# Altium project conn_board.PrjPcb (part 1 of 3)
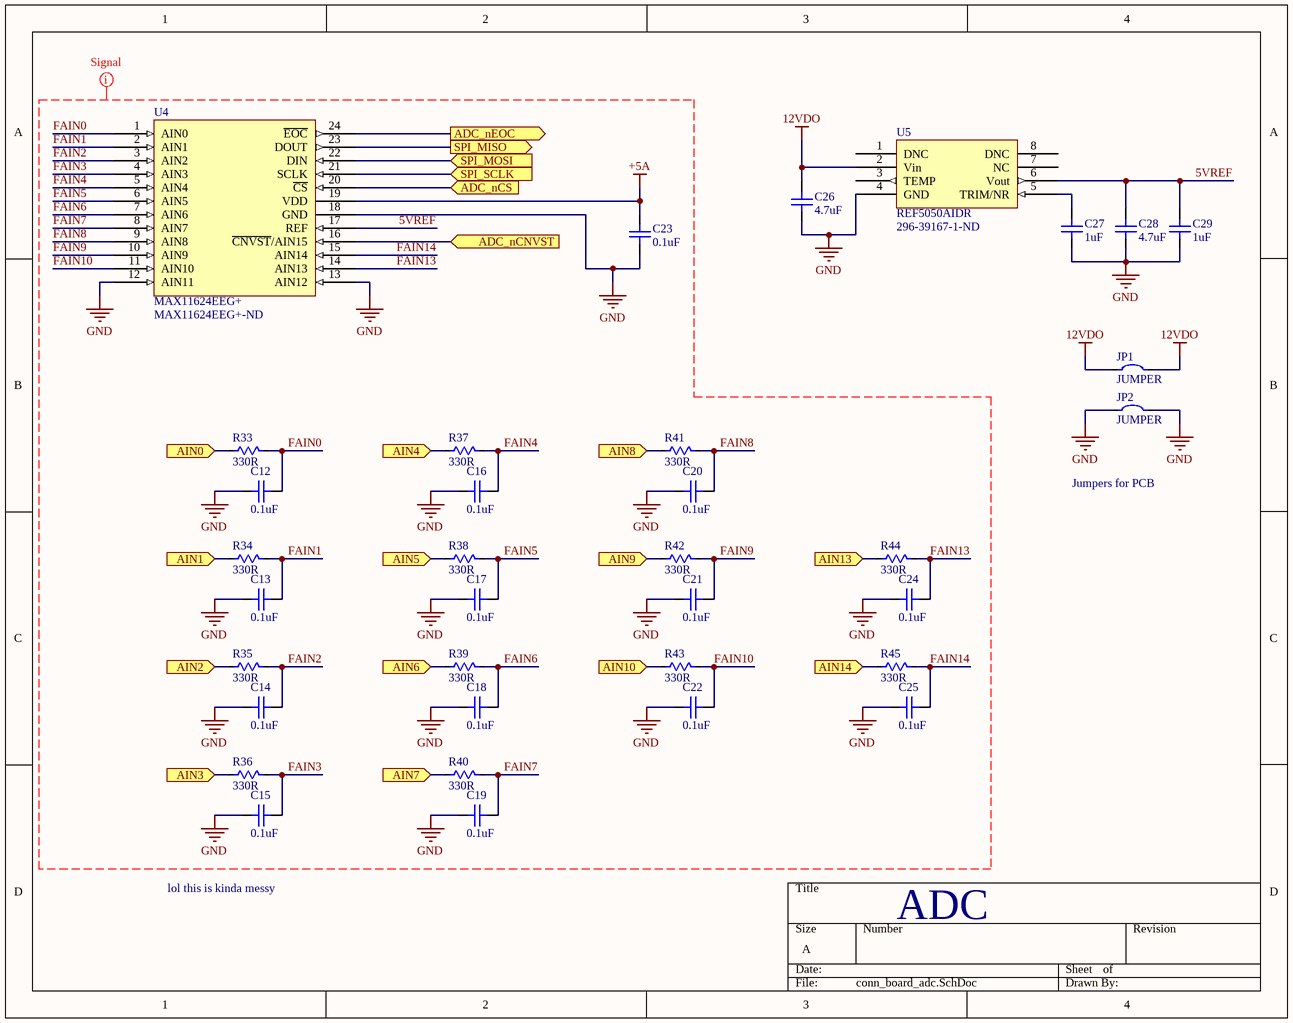
[diagram p0: conn_board_adc.SchDoc]
3 sheets, 85 parts. Net scope: flat (ports and power ports of the same name join across sheets).
Board file: conn_board.PcbDoc
Sheets:
  conn_board_adc.SchDoc
  conn_board_interfaces.SchDoc
  conn_board_power.SchDoc

## Sheet conn_board_adc.SchDoc
size A

### Parts
C12  0.1uF  [CAP_0805]
C13  0.1uF  [CAP_0805]
C14  0.1uF  [CAP_0805]
C15  0.1uF  [CAP_0805]
C16  0.1uF  [CAP_0805]
C17  0.1uF  [CAP_0805]
C18  0.1uF  [CAP_0805]
C19  0.1uF  [CAP_0805]
C20  0.1uF  [CAP_0805]
C21  0.1uF  [CAP_0805]
C22  0.1uF  [CAP_0805]
C23  0.1uF  [CAP_0805]
C24  0.1uF  [CAP_0805]
C25  0.1uF  [CAP_0805]
C26  4.7uF  [CAP_0805]
C27  1uF  [CAP_0805]
C28  4.7uF  [CAP_0805]
C29  1uF  [CAP_0805]
JP1  JUMPER  [JMP_20MM]
JP2  JUMPER  [JMP_20MM]
R33  330R  [RES_0805_PANASONIC]
R34  330R  [RES_0805_PANASONIC]
R35  330R  [RES_0805_PANASONIC]
R36  330R  [RES_0805_PANASONIC]
R37  330R  [RES_0805_PANASONIC]
R38  330R  [RES_0805_PANASONIC]
R39  330R  [RES_0805_PANASONIC]
R40  330R  [RES_0805_PANASONIC]
R41  330R  [RES_0805_PANASONIC]
R42  330R  [RES_0805_PANASONIC]
R43  330R  [RES_0805_PANASONIC]
R44  330R  [RES_0805_PANASONIC]
R45  330R  [RES_0805_PANASONIC]
U4  MAX11624EEG+  Supplier Part Number 1: MAX11624EEG+-ND  [QSOP24]
U5  REF5050AIDR  Supplier Part Number 1: 296-39167-1-ND  [SOIC_8]

### Ports
ADC_nCNVST (in), ADC_nCS (in), ADC_nEOC (out), AIN0 (in), AIN1 (in), AIN2 (in), AIN3 (in), AIN4 (in), AIN5 (in), AIN6 (in), AIN7 (in), AIN8 (in), AIN9 (in), AIN10 (in), AIN13 (in), AIN14 (in), SPI_MISO (out), SPI_MOSI (in), SPI_SCLK (in)

### Nets
12VDO: C26.2 JP1.1 JP1.2 U5.2(Vin)
+5A: C23.1 U4.19(VDD)
GND: C12.1 C13.1 C14.1 C15.1 C16.1 C17.1 C18.1 C19.1 C20.1 C21.1 C22.1 C23.2 C24.1 C25.1 C26.1 C27.1 C28.1 C29.1 JP2.1 JP2.2 U4.12(AIN11) U4.13(AIN12) U4.18(GND) U5.4(GND)
5VREF: C28.2 C29.2 U4.17(REF) U5.6(Vout)
AIN0: R33.1 ; port AIN0
AIN1: R34.1 ; port AIN1
AIN2: R35.1 ; port AIN2
AIN3: R36.1 ; port AIN3
AIN4: R37.1 ; port AIN4
AIN5: R38.1 ; port AIN5
AIN6: R39.1 ; port AIN6
AIN7: R40.1 ; port AIN7
AIN8: R41.1 ; port AIN8
AIN9: R42.1 ; port AIN9
AIN10: R43.1 ; port AIN10
FAIN0: C12.2 R33.2 U4.1(AIN0)
FAIN1: C13.2 R34.2 U4.2(AIN1)
FAIN2: C14.2 R35.2 U4.3(AIN2)
FAIN3: C15.2 R36.2 U4.4(AIN3)
FAIN4: C16.2 R37.2 U4.5(AIN4)
FAIN5: C17.2 R38.2 U4.6(AIN5)
FAIN6: C18.2 R39.2 U4.7(AIN6)
FAIN7: C19.2 R40.2 U4.8(AIN7)
FAIN8: C20.2 R41.2 U4.9(AIN8)
FAIN9: C21.2 R42.2 U4.10(AIN9)
FAIN10: C22.2 R43.2 U4.11(AIN10)
FAIN13: C24.2 R44.2 U4.14(AIN13)
FAIN14: C25.2 R45.2 U4.15(AIN14)
NetC27_2: C27.2 U5.5(TRIM/NR)
NetP3_6: U4.16(~{CNVST}/AIN15) ; port ADC_nCNVST
NetP3_7: U4.20(~{CS}) ; port ADC_nCS
NetP3_8: U4.21(SCLK) ; port SPI_SCLK
NetP3_9: U4.22(DIN) ; port SPI_MOSI
NetP3_10: U4.23(DOUT) ; port SPI_MISO
NetP3_11: U4.24(~{EOC}) ; port ADC_nEOC
NetR5_1: R45.1 ; port AIN14
NetR10_1: R44.1 ; port AIN13

Not connected (* = marked no-connect by the designer): U5 1(DNC) 3(TEMP) 7(NC) 8(DNC)

### Layout directives
net class Signal: 5VREF, +5A, FAIN0, FAIN1, FAIN2, FAIN3, FAIN4, FAIN5, FAIN6, FAIN7, FAIN8, FAIN9, FAIN10, FAIN13, FAIN14, GND

### Notes on the sheet
- Jumpers for PCB
- lol this is kinda messy
- ADC

### Library data of the parts
C12-C25 = C0805C104M3RACTU: CAP CER 0.1UF 25V X7R 0805; Manufacturer: KEMET; Dielectric Material: Ceramic; Capacitance: 100nF; Tolerance: 20%; Dissipation Factor: 5%; Supplier 1: Digi-Key; Manufacturer Part Number: C0805C104M3RACTU; RoHS: Yes; Category: Capacitor; Stock 1: 305175; Pricing 1: 1=0.10000, 10=0.06800, 50=0.03700, 100=0.03020, 500=0.02160, 1000=0.01697 (USD); Mount: Surface Mount; Case/Package: 0805; Case Code (Metric): 2012; Case Code (Imperial): 0805; Min Operating Temperature: -55°C; Max Operating Temperature: 125°C; Packaging: Tape and Reel; Package Quantity: 1; Voltage Rating (DC): 25V; Dielectric: X7R; Voltage Rating: 25V; Termination: SMD/SMT; Voltage: 25V; Length: 2mm; Height: 0.9mm; Width: 0.049inch; Thickness: 0.035inch; Depth: 1.25mm; Lead Pitch: 0.75mm; Radiation Hardening: No; REACH SVHC: No SVHC; ComponentLink1URL: http://www.mouser.com/ds/2/212/KEM_C1002_X7R_SMD-1102033.pdf?src-supplier=Mouser; ComponentLink1Description: http://www.mouser.com/ds/2/212/KEM_C1002_X7R_SMD-1102033.pdf?src-supplier=Mouser; ComponentLink2URL: http://uk.rs-online.com/webdocs/13da/0900766b813da9ff.pdf?src-supplier=RSComponents; ComponentLink2Description: http://uk.rs-online.com/webdocs/13da/0900766b813da9ff.pdf?src-supplier=RSComponents; ComponentLink3URL: http://components.arrow.com/part/dataview/0323_00178100?src-supplier=Arrow+Europe; ComponentLink3Description: http://components.arrow.com/part/dataview/0323_00178100?src-supplier=Arrow+Europe; ComponentLink4URL: https://www.alliedelec.com/m/d/6f3b5eb83d09db50ed28bdc730567b33.pdf?src-supplier=Allied+Electronics; ComponentLink4Description: https://www.alliedelec.com/m/d/6f3b5eb83d09db50ed28bdc730567b33.pdf?src-supplier=Allied+Electronics; ComponentLink5URL: http://www.farnell.com/datasheets/2746330.pdf?src-supplier=Farnell; ComponentLink5Description: http://www.farnell.com/datasheets/2746330.pdf?src-supplier=Farnell; Supplier Part Number 1: 399-8000-1-ND; ComponentLink6URL: http://www.jameco.com/Jameco/Products/ProdDS/1566487.pdf?src-supplier=Jameco; ComponentLink6Description: http://www.jameco.com/Jameco/Products/ProdDS/1566487.pdf?src-supplier=Jameco; ComponentLink7URL: http://components.arrow.com/part/dataview/2091097S3491315N7429?src-supplier=Arrow+Electronics; ComponentLink7Description: http://components.arrow.com/part/dataview/2091097S3491315N7429?src-supplier=Arrow+Electronics; ComponentLink8URL: https://www.alliedelec.com/m/d/e7aa2b5497e2375e4ffc0e8be19e16e2.pdf?src-supplier=Allied+Electronics; ComponentLink8Description: https://www.alliedelec.com/m/d/e7aa2b5497e2375e4ffc0e8be19e16e2.pdf?src-supplier=Allied+Electronics; ComponentLink9URL: http://uk.rs-online.com/webdocs/13da/0900766b813daa05.pdf?src-supplier=RSComponents; ComponentLink9Description: http://uk.rs-online.com/webdocs/13da/0900766b813daa05.pdf?src-supplier=RSComponents; ComponentLink10URL: http://www.farnell.com/datasheets/2746330.pdf?src-supplier=Element14; ComponentLink10Description: http://www.farnell.com/datasheets/2746330.pdf?src-supplier=Element14; ComponentLink11URL: https://api.kemet.com/component-edge/download/datasheet/C0805C104M3RACTU.pdf?src-supplier=Digi-Key; ComponentLink11Description: https://api.kemet.com/component-edge/download/datasheet/C0805C104M3RACTU.pdf?src-supplier=Digi-Key; ComponentLink12URL: http://www.farnell.com/datasheets/1828800.pdf?src-supplier=Newark; ComponentLink12Description: http://www.farnell.com/datasheets/1828800.pdf?src-supplier=Newark; ComponentLink13URL: http://www.farnell.com/datasheets/2746330.pdf?src-supplier=Newark; ComponentLink13Description: http://www.farnell.com/datasheets/2746330.pdf?src-supplier=Newark; ComponentLink14URL: http://capacitoredge.kemet.com/capedge2/DataSheet?pn=C0805C104M3RACTU&src-supplier=Avnet; ComponentLink14Description: http://capacitoredge.kemet.com/capedge2/DataSheet?pn=C0805C104M3RACTU&src-supplier=Avnet
C26 C28 = CL21A475KAQNNNE: SAMSUNG ELECTRO-MECHANICS - CL21A475KAQNNNE - SMD Multilayer Ceramic Capacitor, 4.7 µF, 25 V, 0805 [2012 Metric], ± 10%, X5R, CL Series; Voltage Rating (DC): 25V; Supplier 1: Digi-Key; Manufacturer: Samsung; Manufacturer Part Number: CL21A475KAQNNNE; RoHS: Yes; Category: Ceramic Capacitors; Stock 1: 671990; Pricing 1: 1=0.11000, 10=0.08100, 50=0.04600, 100=0.03820, 500=0.02678, 1000=0.02216 (USD); Mount: Surface Mount; Case/Package: 0805; Case Code (Metric): 2012; Case Code (Imperial): 0805; Min Operating Temperature: -55°C; Max Operating Temperature: 85°C; Dielectric: X5R; Package Quantity: 1; Packaging: Tape and Reel; Capacitance: 4.7uF; Tolerance: 10%; Voltage Rating: 25V; Length: 2mm; Width: 0.049inch; Height: 1.25mm; Thickness: 0.055inch; Depth: 1.25mm; Radiation Hardening: No; Lead Free: Lead Free; ComponentLink1URL: https://datasheet.ciiva.com/25798/cl21a475kaqnnne-25798882.pdf?src-supplier=Digi-Key; ComponentLink1Description: https://datasheet.ciiva.com/25798/cl21a475kaqnnne-25798882.pdf?src-supplier=Digi-Key; Supplier Part Number 1: 1276-1244-1-ND
C27 C29 = C0805C105Z4VACTU: Cap Ceramic 1uF 16V Y5V -20% to 80% Pad SMD 0805 85C T/R; Manufacturer: KEMET; Dissipation Factor: 7%; Supplier 1: Digi-Key; Manufacturer Part Number: C0805C105Z4VACTU; Category: Capacitor; Stock 1: 83211; Pricing 1: 1=0.11000, 10=0.08100, 50=0.04420, 100=0.03620, 500=0.02584, 1000=0.02030 (USD); Mount: Surface Mount; Case/Package: 0805; Number of Pins: 2; Case Code (Metric): 2012; Case Code (Imperial): 0805; Contact Material: Tin; Dielectric Material: Ceramic; Min Operating Temperature: -30°C; Max Operating Temperature: 85°C; Package Quantity: 1; Capacitance: 1uF; Voltage Rating: 16V; Tolerance: 80%; Packaging: Tape and Reel; Voltage Rating (DC): 16V; Dielectric: Y5V; Termination: SMD/SMT; Voltage: 16V; Length: 2mm; Height: 1.25mm; Width: 0.049inch; Thickness: 0.055inch; Lead Pitch: 0.75mm; Depth: 1.25mm; Radiation Hardening: No; REACH SVHC: No SVHC; Lead Free: Lead Free; ComponentLink1URL: https://datasheet.ciiva.com/6074/1698780-6074369.pdf?src-supplier=Farnell; ComponentLink1Description: https://datasheet.ciiva.com/6074/1698780-6074369.pdf?src-supplier=Farnell; ComponentLink2URL: https://datasheet.ciiva.com/16623/datasheetpn-c0805c105z4vac7800-16623623.pdf?src-supplier=Avnet+Europe; ComponentLink2Description: https://datasheet.ciiva.com/16623/datasheetpn-c0805c105z4vac7800-16623623.pdf?src-supplier=Avnet+Europe; ComponentLink3URL: https://datasheet.ciiva.com/14604/70095383-14604106.pdf?src-supplier=Allied+Electronics; ComponentLink3Description: https://datasheet.ciiva.com/14604/70095383-14604106.pdf?src-supplier=Allied+Electronics; ComponentLink4URL: https://datasheet.ciiva.com/7600/1698780-7600029.pdf?src-supplier=Newark; ComponentLink4Description: https://datasheet.ciiva.com/7600/1698780-7600029.pdf?src-supplier=Newark; ComponentLink5URL: https://datasheet.ciiva.com/14589/70095383-14589407.pdf?src-supplier=Allied+Electronics; ComponentLink5Description: https://datasheet.ciiva.com/14589/70095383-14589407.pdf?src-supplier=Allied+Electronics; ComponentLink6URL: http://datasheet.octopart.com/C0805C105Z4VACTU-Kemet-datasheet-13692877.pdf?src-supplier=Element14; ComponentLink6Description: http://datasheet.octopart.com/C0805C105Z4VACTU-Kemet-datasheet-13692877.pdf?src-supplier=Element14; ComponentLink7URL: http://datasheet.octopart.com/C0805C105Z4VACTU-Kemet-datasheet-503297.pdf?src-supplier=Newark; ComponentLink7Description: http://datasheet.octopart.com/C0805C105Z4VACTU-Kemet-datasheet-503297.pdf?src-supplier=Newark; ComponentLink8URL: http://datasheet.octopart.com/C0805C105Z4VACTU-KEMET-datasheet-101576167.pdf?src-supplier=Farnell; ComponentLink8Description: http://datasheet.octopart.com/C0805C105Z4VACTU-KEMET-datasheet-101576167.pdf?src-supplier=Farnell; ComponentLink9URL: http://datasheet.octopart.com/C0805C105Z4VACTU-KEMET-datasheet-83957834.pdf?src-supplier=TME; ComponentLink9Description: http://datasheet.octopart.com/C0805C105Z4VACTU-KEMET-datasheet-83957834.pdf?src-supplier=TME; ComponentLink10URL: http://datasheet.octopart.com/C0805C105Z4VACTU-Kemet-datasheet-5313890.pdf?src-supplier=Verical; ComponentLink10Description: http://datasheet.octopart.com/C0805C105Z4VACTU-Kemet-datasheet-5313890.pdf?src-supplier=Verical; ComponentLink11URL: http://datasheet.octopart.com/C0805C105Z4VAC-TU-Kemet-datasheet-8204015.pdf?src-supplier=Jameco; ComponentLink11Description: http://datasheet.octopart.com/C0805C105Z4VAC-TU-Kemet-datasheet-8204015.pdf?src-supplier=Jameco; ComponentLink12URL: http://datasheet.octopart.com/C0805C105Z4VACTU-Kemet-datasheet-464.pdf?src-supplier=Allied+Electronics; ComponentLink12Description: http://datasheet.octopart.com/C0805C105Z4VACTU-Kemet-datasheet-464.pdf?src-supplier=Allied+Electronics; ComponentLink13URL: http://datasheet.octopart.com/C0805C105Z4VACTU-Kemet-datasheet-11554470.pdf?src-supplier=Arrow; ComponentLink13Description: http://datasheet.octopart.com/C0805C105Z4VACTU-Kemet-datasheet-11554470.pdf?src-supplier=Arrow; ComponentLink14URL: http://datasheet.octopart.com/C0805C105Z4VACTU-Kemet-datasheet-66128697.pdf?src-supplier=Element14; ComponentLink14Description: http://datasheet.octopart.com/C0805C105Z4VACTU-Kemet-datasheet-66128697.pdf?src-supplier=Element14; ComponentLink15URL: http://datasheet.octopart.com/C0805C105Z4VACTU-Kemet-datasheet-66325528.pdf?src-supplier=Newark; ComponentLink15Description: http://datasheet.octopart.com/C0805C105Z4VACTU-Kemet-datasheet-66325528.pdf?src-supplier=Newark; ComponentLink16URL: http://datasheet.octopart.com/C0805C105Z4VACTU-Kemet-datasheet-67847115.pdf?src-supplier=TME; ComponentLink16Description: http://datasheet.octopart.com/C0805C105Z4VACTU-Kemet-datasheet-67847115.pdf?src-supplier=TME; ComponentLink17URL: http://datasheet.octopart.com/C0805C105Z4VACTU-KEMET-datasheet-84169754.pdf; ComponentLink17Description: http://datasheet.octopart.com/C0805C105Z4VACTU-KEMET-datasheet-84169754.pdf; ComponentLink18URL: http://datasheet.octopart.com/C0805C105Z4VACTU-KEMET-datasheet-41193421.pdf?src-supplier=Master+Electronics; ComponentLink18Description: http://datasheet.octopart.com/C0805C105Z4VACTU-KEMET-datasheet-41193421.pdf?src-supplier=Master+Electronics; Supplier Part Number 1: 399-8011-1-ND
R33-R45 = ERA-6AED331V: Res Thin Film 0805 330 Ohm 0.5% 0.125W(1/8W) ±25ppm/C Molded SMD Automotive Punched T/R; Manufacturer: Panasonic; Temperature Coefficient: 25ppm/°C; Power Rating: 125mW; Voltage Rating: 200V; Supplier 1: Digi-Key; Manufacturer Part Number: ERA-6AED331V; RoHS: Yes; Category: Resistor; Stock 1: 11862; Pricing 1: 1=0.10000, 10=0.09400, 25=0.06480, 50=0.05040, 100=0.03600, 250=0.02808, 500=0.02232, 1000=0.01584 (USD); Case/Package: 0805; Case Code (Metric): 2012; Case Code (Imperial): 0805; Min Operating Temperature: -55°C; Max Operating Temperature: 155°C; Package Quantity: 5000; Packaging: Tape and Reel; Resistance: 330R; Tolerance: 0.5%; Length: 2mm; Height: 0.5mm; Width: 1.25mm; Lead Free: Lead Free; ComponentLink1URL: https://datasheet.ciiva.com/24071/aoa0000ce26-197354-24071480.pdf?src-supplier=Mouser; ComponentLink1Description: https://datasheet.ciiva.com/24071/aoa0000ce26-197354-24071480.pdf?src-supplier=Mouser; Supplier Part Number 1: P123837CT-ND; Mount: Surface Mount; Contact Plating: Tin; Termination: SMD/SMT; Resistor Type: Thin Film; Depth: 1.25mm; Military Standard: Not; ComponentLink2URL: https://datasheet.ciiva.com/9182/aoa0000ce26-9182970.pdf?src-supplier=Avnet; ComponentLink2Description: https://datasheet.ciiva.com/9182/aoa0000ce26-9182970.pdf?src-supplier=Avnet
U4 = MAX11624EEG+: GLOVE, POLYAMIDE, L/FREE, PU, SIZE 6 - More Details; Manufacturer: Maxim; Resolution: 10b; Sampling Rate: 300000S/s; Number of A/D Converters: 1; Number of Analog Inputs: 16; Polarity: Unipolar; Signal to Noise Ratio (SNR): 49dB; Number of Bits: 10; Supply Type: Single; Conversion Rate: 300KS/s; Interface: SPI,Serial; Max Power Dissipation: 762mW; Operating Supply Voltage: 5.25V; Supplier 1: Digi-Key; Manufacturer Part Number: MAX11624EEG+; RoHS: Yes; Category: IC; Stock 1: 35; Pricing 1: 1=6.76000, 10=6.11000, 25=5.82520, 100=4.83080, 250=4.82100 (USD); Mount: Surface Mount; Case/Package: QSOP; Number of Pins: 24; Min Operating Temperature: -40°C; Max Operating Temperature: 85°C; Number of Converters: 1; Packaging: Rail/Tube; Number of Channels: 16; Package Quantity: 50; Radiation Hardening: No; ComponentLink1URL: https://datasheet.ciiva.com/16611/max11618-max11625-16611389.pdf?src-supplier=Avnet+Europe; ComponentLink1Description: https://datasheet.ciiva.com/16611/max11618-max11625-16611389.pdf?src-supplier=Avnet+Europe; ComponentLink2URL: https://datasheet.ciiva.com/3039/max11618-max11625-3039027.pdf?src-supplier=Avnet; ComponentLink2Description: https://datasheet.ciiva.com/3039/max11618-max11625-3039027.pdf?src-supplier=Avnet
U5 = REF5050AIDR: TEXAS INSTRUMENTS - REF5050AIDR - VOLTAGE REF, SERIES, 5V, SOIC-8; Max Input Voltage: 18V; Max Output Current: 10mA; Min Input Voltage: 5.2V; Temperature Coefficient: 3ppm/°C; Quiescent Current: 1mA; Tolerance: 0.1%; Nominal Supply Current: 800uA; Number of Channels: 1; Operating Supply Current: 1.2mA; Output Type: Fixed; Supplier 1: Digi-Key; Manufacturer: Texas Instruments; Manufacturer Part Number: REF5050AIDR; RoHS: Yes; Category: Voltage References; Stock 1: 3640; Pricing 1: 1=2.92000, 10=2.61800, 25=2.47520, 100=2.03500, 250=1.82600, 500=1.76000, 1000=1.46300 (USD); Case/Package: D; Number of Pins: 8; Weight: 0.002677oz; Min Operating Temperature: -40°C; Max Operating Temperature: 125°C; Output Voltage: 5V; Packaging: Tape and Reel; Package Quantity: 2500; Output Current: 10mA; Reference Type: Series; Reference Voltage: 5V; Min Output Voltage: 5V; Radiation Hardening: No; Lead Free: Lead Free; REACH SVHC: No SVHC; ComponentLink1URL: https://datasheet.ciiva.com/4065/43001021s8324725n7713-4065643.pdf?src-supplier=Arrow+Electronics; ComponentLink1Description: https://datasheet.ciiva.com/4065/43001021s8324725n7713-4065643.pdf?src-supplier=Arrow+Electronics; ComponentLink2URL: https://datasheet.ciiva.com/3236/ref5050-3236312.pdf?src-supplier=Avnet; ComponentLink2Description: https://datasheet.ciiva.com/3236/ref5050-3236312.pdf?src-supplier=Avnet; ComponentLink3URL: https://datasheet.ciiva.com/2012/ref5020-2012761.pdf?src-supplier=Digi-Key; ComponentLink3Description: https://datasheet.ciiva.com/2012/ref5020-2012761.pdf?src-supplier=Digi-Key

## Sheet conn_board_interfaces.SchDoc
size A
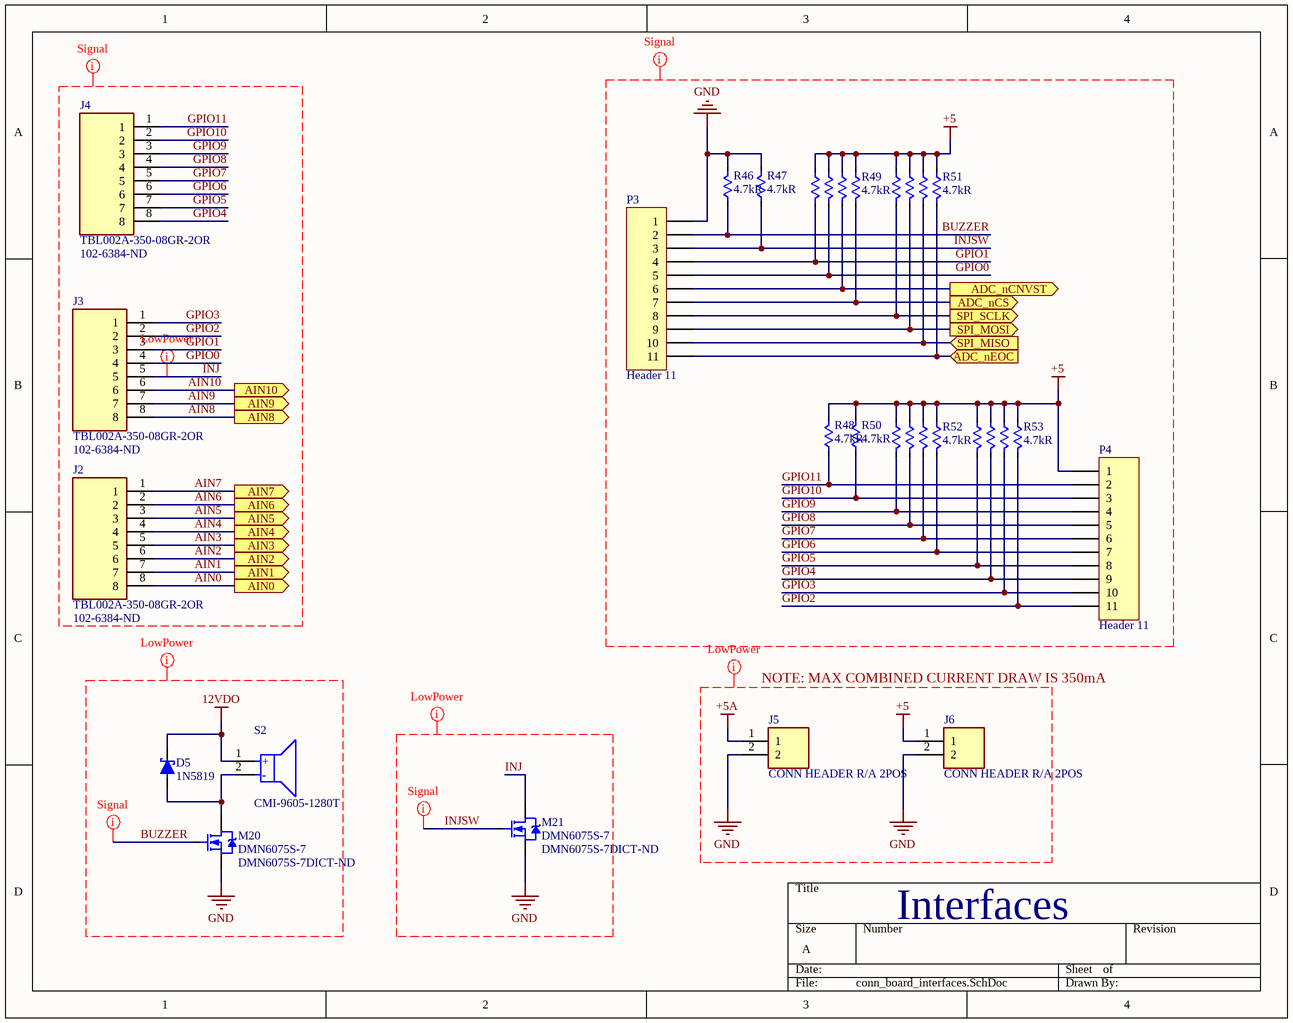
[diagram p1: conn_board_interfaces.SchDoc]

### Parts
D5  1N5819  [SOD123]
J2  TBL002A-350-08GR-2OR  Supplier Part Number 1: 102-6384-ND  [CUI_TBL002A-350-08GR-2OR]
J3  TBL002A-350-08GR-2OR  Supplier Part Number 1: 102-6384-ND  [CUI_TBL002A-350-08GR-2OR]
J4  TBL002A-350-08GR-2OR  Supplier Part Number 1: 102-6384-ND  [CUI_TBL002A-350-08GR-2OR]
J5  CONN HEADER R/A 2POS  [2 POS MOLEX]
J6  CONN HEADER R/A 2POS  [2 POS MOLEX]
M20  DMN6075S-7  Supplier Part Number 1: DMN6075S-7DICT-ND  [FP-SOT23-MFG]
M21  DMN6075S-7  Supplier Part Number 1: DMN6075S-7DICT-ND  [FP-SOT23-MFG]
P3  Header 11  [HDR1X11]
P4  Header 11  [HDR1X11]
R46  4.7kR  [RES_0805_PANASONIC]
R47  4.7kR  [RES_0805_PANASONIC]
R48  4.7kR  [RES_0805_PANASONIC]
R49  4.7kR  [CAY16-472J4LF]
R50  4.7kR  [RES_0805_PANASONIC]
R51  4.7kR  [CAY16-472J4LF]
R52  4.7kR  [CAY16-472J4LF]
R53  4.7kR  [CAY16-472J4LF]
S2  CMI-9605-1280T  [CMI-9605-1280T]

### Ports
ADC_nCNVST (out), ADC_nCS (out), ADC_nEOC (in), AIN0 (out), AIN1 (out), AIN2 (out), AIN3 (out), AIN4 (out), AIN5 (out), AIN6 (out), AIN7 (out), AIN8 (out), AIN9 (out), AIN10 (out), SPI_MISO (in), SPI_MOSI (out), SPI_SCLK (out)

### Nets
12VDO: D5.1 S2.1(+)
+5: J6.1 P4.1 R48.2 R49.2 R49.4 R49.6 R49.8 R50.2 R51.2 R51.4 R51.6 R51.8 R52.2 R52.4 R52.6 R52.8 R53.2 R53.4 R53.6 R53.8
+5A: J5.1
GND: J5.2 J6.2 M20.S M21.S P3.1 R46.2 R47.2
AIN0: J2.8 ; port AIN0
AIN1: J2.7 ; port AIN1
AIN2: J2.6 ; port AIN2
AIN3: J2.5 ; port AIN3
AIN4: J2.4 ; port AIN4
AIN5: J2.3 ; port AIN5
AIN6: J2.2 ; port AIN6
AIN7: J2.1 ; port AIN7
AIN8: J3.8 ; port AIN8
AIN9: J3.7 ; port AIN9
AIN10: J3.6 ; port AIN10
BUZZER: M20.G P3.2 R46.1
GPIO0: J3.4 P3.5 R49.3
GPIO1: J3.3 P3.4 R49.1
GPIO2: J3.2 P4.11 R53.7
GPIO3: J3.1 P4.10 R53.5
GPIO4: J4.8 P4.9 R53.3
GPIO5: J4.7 P4.8 R53.1
GPIO6: J4.6 P4.7 R52.7
GPIO7: J4.5 P4.6 R52.5
GPIO8: J4.4 P4.5 R52.3
GPIO9: J4.3 P4.4 R52.1
GPIO10: J4.2 P4.3 R50.1
GPIO11: J4.1 P4.2 R48.1
INJ: J3.5 M21.D
INJSW: M21.G P3.3 R47.1
NetD5_2: D5.2 M20.D S2.2(-)
NetP3_6: P3.6 R49.5 ; port ADC_nCNVST
NetP3_7: P3.7 R49.7 ; port ADC_nCS
NetP3_8: P3.8 R51.1 ; port SPI_SCLK
NetP3_9: P3.9 R51.3 ; port SPI_MOSI
NetP3_10: P3.10 R51.5 ; port SPI_MISO
NetP3_11: P3.11 R51.7 ; port ADC_nEOC

### Layout directives
net class Signal: +5, AIN0, AIN1, AIN2, AIN3, AIN4, AIN5, AIN6, AIN7, AIN8, AIN9, AIN10, BUZZER, GND, GPIO0, GPIO1, GPIO2, GPIO3, GPIO4, GPIO5, GPIO6, GPIO7, GPIO8, GPIO9, GPIO10, GPIO11, INJ, INJSW
net class LowPower: 12VDO, +5, +5A, BUZZER, GND, INJ, INJSW
mark named Signal: BUZZER, INJSW

### Notes on the sheet
- NOTE: MAX COMBINED CURRENT DRAW IS 350mA
- Interfaces

### Library data of the parts
D5 = 1N5819HW-7-F: DIODES INC. - 1N5819HW-7-F - DIODE, SCKY RECTI, 1A, 40V, SOD123; Element Configuration: Single; Peak Non-Repetitive Surge Current: 25A; Forward Voltage: 450mV; Peak Reverse Current: 50uA; Polarity: Standard; Capacitance: 110pF; Max Power Dissipation: 450mW; Supplier 1: Digi-Key; Manufacturer: Diodes; Manufacturer Part Number: 1N5819HW-7-F; RoHS: Yes; Category: Diode; Stock 1: 502732; Pricing 1: 1=0.40000, 10=0.30100, 25=0.26360, 100=0.14310, 500=0.11678, 1000=0.08664 (USD); Case/Package: SOD-123-2; Number of Pins: 2; Weight: 0.000353oz; Contact Plating: Tin,Matte; Min Operating Temperature: -65°C; Max Operating Temperature: 125°C; Packaging: Tape and Reel; Package Quantity: 3000; Forward Current: 1A; Max Repetitive Reverse Voltage (Vrrm): 40V; Average Rectified Current: 1A; Max Reverse Voltage (DC): 40V; Max Forward Surge Current (Ifsm): 25A; Current Rating: 1A; Voltage Rating (DC): 40V; Output Current: 1A; Termination: SMD/SMT; Length: 2.85mm; Height: 1.25mm; Width: 1.7mm; Radiation Hardening: No; Lead Free: Lead Free; REACH SVHC: No SVHC; ComponentLink1URL: https://datasheet.ciiva.com/16303/ds30217-16303296.pdf?src-supplier=Future+Electronics; ComponentLink1Description: https://datasheet.ciiva.com/16303/ds30217-16303296.pdf?src-supplier=Future+Electronics; ComponentLink2URL: https://datasheet.ciiva.com/27092/1538419-27092484.pdf?src-supplier=Jameco; ComponentLink2Description: https://datasheet.ciiva.com/27092/1538419-27092484.pdf?src-supplier=Jameco; ComponentLink3URL: https://datasheet.ciiva.com/912/ds30217-912801.pdf?src-supplier=Digi-Key; ComponentLink3Description: https://datasheet.ciiva.com/912/ds30217-912801.pdf?src-supplier=Digi-Key; ComponentLink4URL: https://datasheet.ciiva.com/1177/ds30217-1177089.pdf?src-supplier=Element14; ComponentLink4Description: https://datasheet.ciiva.com/1177/ds30217-1177089.pdf?src-supplier=Element14; ComponentLink5URL: https://datasheet.ciiva.com/912/ds30217-912802.pdf?src-supplier=Digi-Key; ComponentLink5Description: https://datasheet.ciiva.com/912/ds30217-912802.pdf?src-supplier=Digi-Key; ComponentLink6URL: https://datasheet.ciiva.com/912/ds30217-912803.pdf?src-supplier=Digi-Key; ComponentLink6Description: https://datasheet.ciiva.com/912/ds30217-912803.pdf?src-supplier=Digi-Key; ComponentLink7URL: https://datasheet.ciiva.com/8303/ds30217-8303132.pdf?src-supplier=Avnet; ComponentLink7Description: https://datasheet.ciiva.com/8303/ds30217-8303132.pdf?src-supplier=Avnet; ComponentLink8URL: https://datasheet.ciiva.com/25919/ds30217-25919644.pdf?src-supplier=Avnet+Europe; ComponentLink8Description: https://datasheet.ciiva.com/25919/ds30217-25919644.pdf?src-supplier=Avnet+Europe; Supplier Part Number 1: 1N5819HW-FDICT-ND
J2-J4 = TBL002A-350-08GR-2OR: 1~24 Poles, Screwless, 45Â°, 3.50 Pitch, 24~20 (AWG), Terminal Block Connector; MF: CUI Devices; SnapEDA_Link: https://www.snapeda.com/parts/TBL002A-350-08GR-2OR/CUI%20Devices/view-part/3233590/?ref=snap; Availability: Unavailable; Price: None; MP: TBL002A-350-08GR-2OR; Package: None; Value: *; Category: Connector; Supplier 1: Digi-Key
J5 J6 = 1724480002: Manufacturer: Molex; Connector Type: Male Pin; Number of Circuits: 2; Row Spacing: 0.165inch; Glow Wire Compliant: Compliant; Supplier 1: Digi-Key; Manufacturer Part Number: 1724480002; RoHS: No; Category: Headers and Wire Housings; Stock 1: 6210; Pricing 1: 1=0.55000, 10=0.46000, 100=0.35780, 1000=0.28116, 5000=0.24708, 10000=0.23004 (USD); Mount: Through Hole; Number of Pins: 2; Contact Plating: Tin; Color: Black; Orientation: Right Angle; Packaging: Tray; Number of Positions: 2; Number of Rows: 2; Termination: Solder; Fastening Type: Ramp; ComponentLink1URL: https://www.molex.com/pdm_docs/sd/1724480002_sd.pdf?src-supplier=Digi-Key; ComponentLink1Description: https://www.molex.com/pdm_docs/sd/1724480002_sd.pdf?src-supplier=Digi-Key; Supplier Part Number 1: WM16206-ND
M20 M21 = CMP-12801-000014-1: MOSFET 60V N-Ch Enh FET 20Vgss 0.8W 600pF; Manufacturer: Diodes Inc.; Max Junction Temp: +150°C; Continuous Drain Current: 2A; Rthja Max: 157°C/W; Turn On Delay Time: 3.5ns; Gate To Source Voltage: 20V; Input Capacitace At Vds: 606pF @ 20V; Depletion Mode: False; Number Of Channels: 1; Pulse Drain Current: 12A; Standoff Height: 0.013mm; Turn Off Delay Time: 35ns; Threshold Vgs Max: 3V; Automotive Grade: Grade 0; Max Forward Diode Voltage: 1.2V; Gate Charge At Vgs: 12.3nC @ 10V; Threshold Vgs Min: 1V; Drain To Source Resistance: 69mΩ; Rds On Max: 85mR; Input Capacitance: 606pF; Max Power Dissipation: 800mW; Device Class L2: Transistors; Height: 1.1mm; ComponentLink2Description: Datasheet; Footprint Url: https://www.diodes.com/assets/Package-Files/SOT23.pdf; Device Class L1: Discrete Semiconductors; Digikey Description: MOSFET N-CH 60V 2A SOT23-3; Device Class L3: MOSFETs; Mouser Description: MOSFET 60V N-Ch Enh FET 20Vgss 0.8W 600pF; Manufacturer Part Number: DMN6075S-7; Package: SOT23; Power Dissipation: 0.8W; Temperature Range High: +150°C; Drain To Source Breakdown Voltage: 60V; Automotive: Yes; Lead Free: Yes; ComponentLink2URL: https://www.diodes.com/assets/Datasheets/DMN6075S.pdf; Category: Trans; Temperature Range Low: -55°C; Number Of N Channels: 1; Octopart: https://octopart.com/dmn6075s-7-diodes+inc.-55697882; RoHS: TRUE; Temperature: -55°C to +150°C; Drain To Source Voltage: 60V; Supplier 1: Digi-Key; Stock 1: 363651; Pricing 1: 1=0.33000, 10=0.23000, 25=0.21440, 100=0.11630, 500=0.09486, 1000=0.07038 (USD); Mount: Surface Mount; Case/Package: TO-236-3; Min Operating Temperature: -55°C; Max Operating Temperature: 150°C; Packaging: Tape and Reel; Drain to Source Voltage (Vdss): 60V; Continuous Drain Current (ID): 2A; ComponentLink1URL: http://www.mouser.com/ds/2/115/DMN6075S-532804.pdf?src-supplier=Mouser; ComponentLink1Description: http://www.mouser.com/ds/2/115/DMN6075S-532804.pdf?src-supplier=Mouser; ComponentLink3URL: https://www.diodes.com/assets/Datasheets/DMN6075S.pdf?src-supplier=Digi-Key; ComponentLink3Description: https://www.diodes.com/assets/Datasheets/DMN6075S.pdf?src-supplier=Digi-Key
P3 P4 = Header 11: Header, 11-Pin; LatestRevisionDate: 17-Jul-2002; LatestRevisionNote: Re-released for DXP Platform.; Publisher: Altium Limited
R46-R48 R50 = ERA-6AED472V: Res Thin Film 0805 4.7K Ohm 0.5% 0.125W(1/8W) ±25ppm/C Molded SMD Automotive Punched T/R; Manufacturer: Panasonic; Temperature Coefficient: 25ppm/°C; Power Rating: 125mW; Voltage Rating: 100V; Supplier 1: Digi-Key; Manufacturer Part Number: ERA-6AED472V; RoHS: Yes; Category: Chip SMD Resistors; Stock 1: 25343; Pricing 1: 1=0.10000, 10=0.09400, 100=0.03600, 1000=0.01584, 2500=0.01368 (USD); Case/Package: 0805; Case Code (Metric): 2012; Case Code (Imperial): 0805; Min Operating Temperature: -55°C; Max Operating Temperature: 155°C; Package Quantity: 5000; Packaging: Tape and Reel; Resistance: 4.7kR; Tolerance: 0.5%; Length: 2mm; Height: 0.5mm; Width: 1.25mm; Lead Free: Lead Free; ComponentLink1URL: https://datasheet.ciiva.com/24027/aoa0000ce26-32660-24027576.pdf?src-supplier=Mouser; ComponentLink1Description: https://datasheet.ciiva.com/24027/aoa0000ce26-32660-24027576.pdf?src-supplier=Mouser; Supplier Part Number 1: P123914CT-ND; Mount: Surface Mount; Contact Plating: Tin; Resistor Type: Metal Film,Thin Film; Depth: 1.25mm; Military Standard: Not
R49 R51-R53 = CAY16-472J4LF: RES ARRAY 4 RES 4.7K OHM 1206; Manufacturer: Bourns; Number of Resistors: 4; Voltage Rating (DC): 50V; Circuit Type: Isolated; Power Per Element: 62.5mW; Temperature Coefficient: 200ppm/°C; Tolerance: 5%; Power Rating: 248mW; Supplier 1: Digi-Key; Manufacturer Part Number: CAY16-472J4LF; RoHS: Yes; Category: Resistor; Stock 1: 28152; Pricing 1: 1=0.10000, 10=0.06900, 25=0.04760, 50=0.03720, 100=0.02650, 250=0.02068, 500=0.01644, 1000=0.01166 (USD); Mount: Surface Mount; Case/Package: 1206; Number of Pins: 8; Number of Terminals: 8; Contact Plating: Tin; Case Code (Imperial): 1206; Case Code (Metric): 3216; Min Operating Temperature: -55°C; Max Operating Temperature: 125°C; Resistance: 4.7kR; Number of Circuits: 4; Termination: Convex; Military Standard: Not; Composition: Thick Film; Voltage Rating: 50V; Number of Elements: 4; Packaging: Tape and Reel; Package Quantity: 1; Length: 3.2mm; Height: 0.024inch; Terminal Pitch: 0.8mm; Depth: 1.6mm; Width: 0.063inch; Radiation Hardening: No; REACH SVHC: No SVHC; ComponentLink1URL: https://datasheet.ciiva.com/19466/1979708-19466930.pdf?src-supplier=Jameco; ComponentLink1Description: https://datasheet.ciiva.com/19466/1979708-19466930.pdf?src-supplier=Jameco; ComponentLink2URL: https://datasheet.ciiva.com/11807/0900766b8064e462-11807155.pdf?src-supplier=RSComponents; ComponentLink2Description: https://datasheet.ciiva.com/11807/0900766b8064e462-11807155.pdf?src-supplier=RSComponents; ComponentLink3URL: https://datasheet.ciiva.com/1478/1849489-1478912.pdf?src-supplier=Element14; ComponentLink3Description: https://datasheet.ciiva.com/1478/1849489-1478912.pdf?src-supplier=Element14; ComponentLink4URL: https://datasheet.ciiva.com/25907/catcay-25907158.pdf?src-supplier=Avnet+Europe; ComponentLink4Description: https://datasheet.ciiva.com/25907/catcay-25907158.pdf?src-supplier=Avnet+Europe; ComponentLink5URL: https://datasheet.ciiva.com/30249/catcay-30249688.pdf?src-supplier=Onlinecomponents.com; ComponentLink5Description: https://datasheet.ciiva.com/30249/catcay-30249688.pdf?src-supplier=Onlinecomponents.com; ComponentLink6URL: https://datasheet.ciiva.com/6494/catcay-6494015.pdf?src-supplier=Digi-Key; ComponentLink6Description: https://datasheet.ciiva.com/6494/catcay-6494015.pdf?src-supplier=Digi-Key; ComponentLink7URL: https://datasheet.ciiva.com/3264/catcay-3264889.pdf?src-supplier=Avnet; ComponentLink7Description: https://datasheet.ciiva.com/3264/catcay-3264889.pdf?src-supplier=Avnet; ComponentLink8URL: https://datasheet.ciiva.com/3263/catcay-3263770.pdf?src-supplier=Avnet; ComponentLink8Description: https://datasheet.ciiva.com/3263/catcay-3263770.pdf?src-supplier=Avnet; ComponentLink9URL: https://datasheet.ciiva.com/1478/1849489-1478911.pdf?src-supplier=Element14; ComponentLink9Description: https://datasheet.ciiva.com/1478/1849489-1478911.pdf?src-supplier=Element14; Supplier Part Number 1: CAY16-472J4LFCT-ND
S2 = CMI-9605-1280T: Buzzers Indicator, Internally Driven Magnetic 12V 30mA 2.7kHz 80dB @ 12V, 10cm Through Hole PC Pins; Manufacturer: CUI; Supplier 1: Digi-Key; Manufacturer Part Number: CMI-9605-1280T; RoHS: No; Category: Audio Products; Stock 1: 2147; Pricing 1: 1=1.22000, 10=1.01900, 25=0.94360, 50=0.88800, 100=0.83460, 500=0.71806, 1000=0.67126, 5000=0.65780 (USD); Supplier Part Number 1: 102-CMI-9605-1280T-ND

## Sheet conn_board_power.SchDoc
size A
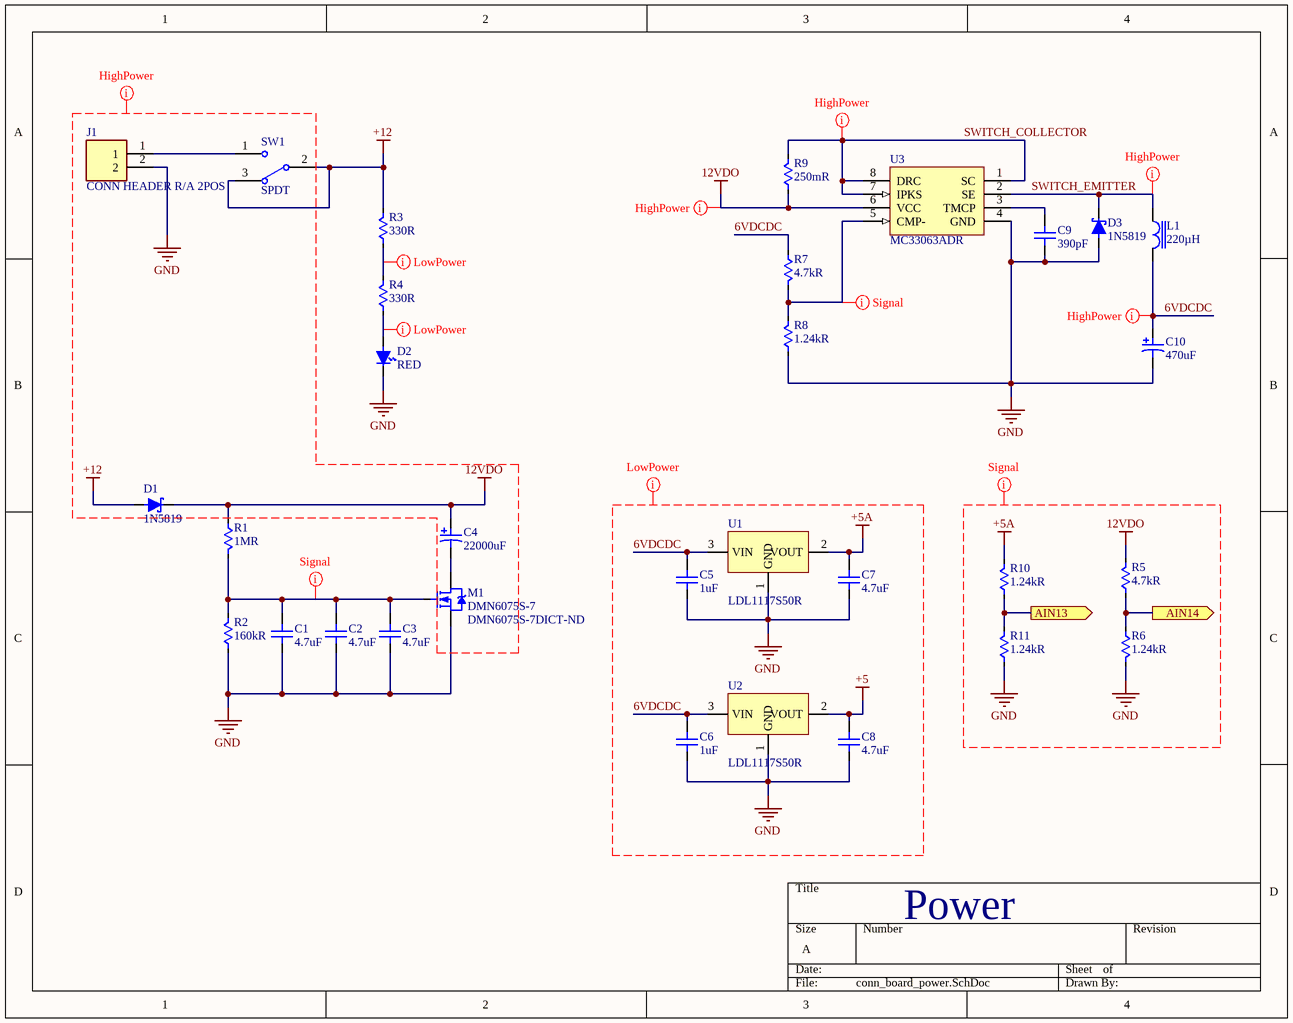
[diagram p2: conn_board_power.SchDoc]

### Parts
C1  4.7uF  [CAP_0805]
C2  4.7uF  [CAP_0805]
C3  4.7uF  [CAP_0805]
C4  22000uF  [UVR1C223MRD6_BENT_F]
C5  1uF  [CAP_0805]
C6  1uF  [CAP_0805]
C7  4.7uF  [CAP_0805]
C8  4.7uF  [CAP_0805]
C9  390pF  [CAP_0805]
C10  470uF  [UUD1C471MNL1GS]
D1  1N5819  [SOD123]
D2  RED  [150080SS75000]
D3  1N5819  [SOD123]
J1  CONN HEADER R/A 2POS  [2 POS MOLEX]
L1  220µH  [INDP125125X600N]
M1  DMN6075S-7  Supplier Part Number 1: DMN6075S-7DICT-ND  [FP-SOT23-MFG]
R1  1MR  [RES_0805_PANASONIC]
R2  160kR  [RES_0805_PANASONIC]
R3  330R  [RES_0805_PANASONIC]
R4  330R  [RES_0805_PANASONIC]
R5  4.7kR  [RES_0805_PANASONIC]
R6  1.24kR  [RES_0805_PANASONIC]
R7  4.7kR  [RES_0805_PANASONIC]
R8  1.24kR  [RES_0805_PANASONIC]
R9  250mR  [CSR1206FKR250]
R10  1.24kR  [RES_0805_PANASONIC]
R11  1.24kR  [RES_0805_PANASONIC]
SW1  SPDT  [100SP1T2B4M6QE]
U1  LDL1117S50R  [SOT230P700X180-4N]
U2  LDL1117S50R  [SOT230P700X180-4N]
U3  MC33063ADR  [SOIC_8]

### Ports
AIN13 (out), AIN14 (out)

### Nets
12VDO: C4.1 D1.1 R1.1 R5.2 R9.1 U3.6(VCC)
+5: C8.2 U2.2(VOUT)
+5A: C7.2 R10.2 U1.2(VOUT)
+12: D1.2 R3.2 SW1.2 SW1.3
GND: C1.1 C2.1 C3.1 C5.1 C6.1 C7.1 C8.1 C9.1 C10.2 D2.1 D3.2 J1.2 M1.S R2.1 R6.2 R8.1 R11.1 U1.1(GND) U2.1(GND) U3.4(GND)
6VDCDC: C5.2 C6.2 C10.1 L1.1 R7.1 U1.3(VIN) U2.3(VIN)
SWITCH_COLLECTOR: R9.2 U3.1(SC) U3.7(IPKS) U3.8(DRC)
SWITCH_EMITTER: D3.1 L1.2 U3.2(SE)
NetC1_2: C1.2 C2.2 C3.2 M1.G R1.2 R2.2
NetC4_2: C4.2 M1.D
NetC9_2: C9.2 U3.3(TMCP)
NetD2_2: D2.2 R4.1
NetJ1_1: J1.1 SW1.1
NetR3_1: R3.1 R4.2
NetR5_1: R5.1 R6.1 ; port AIN14
NetR7_2: R7.2 R8.2 U3.5(CMP-)
NetR10_1: R10.1 R11.2 ; port AIN13

### Layout directives
net class HighPower: 6VDCDC, 12VDO, +12, GND, SWITCH_COLLECTOR, SWITCH_EMITTER
net class LowPower: 6VDCDC, +5, +5A, GND, NetD2_2, NetR3_1
net class Signal: 12VDO, +5A, GND, NetC1_2, NetR7_2

### Notes on the sheet
- Power